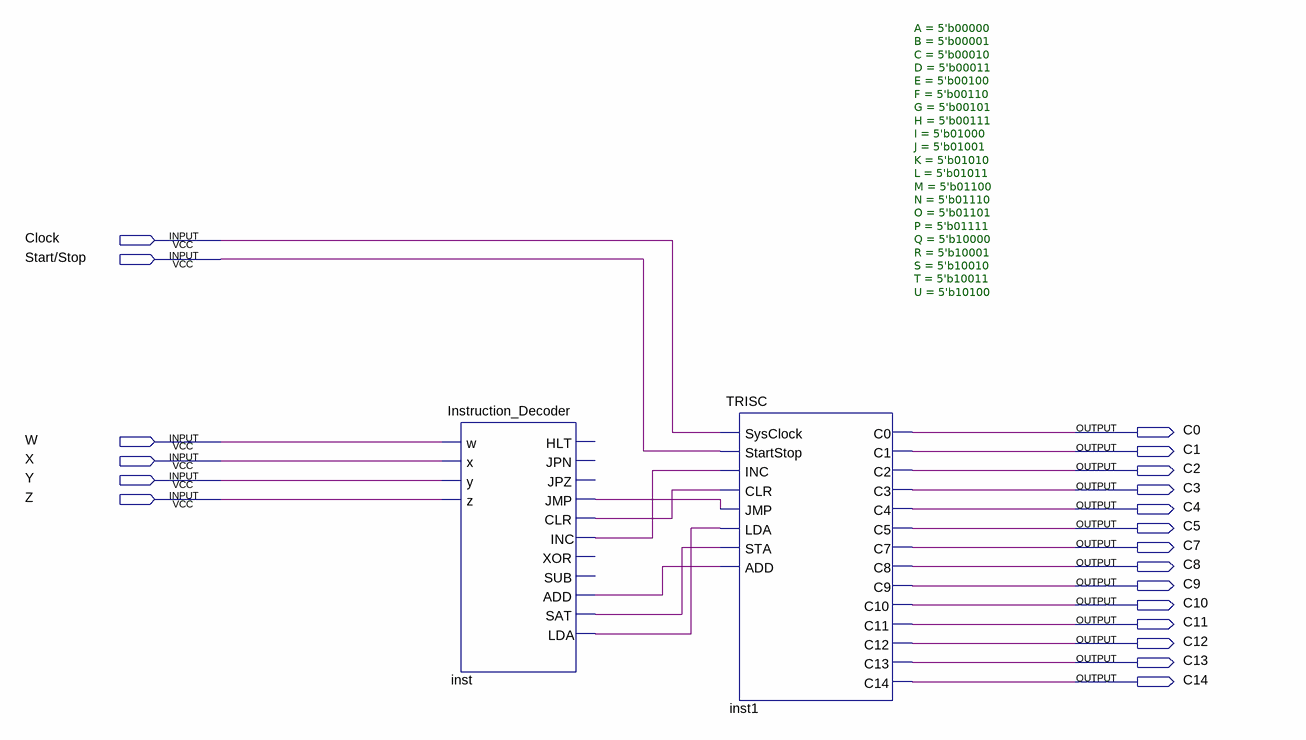
[diagram p0: schematic sheet]
// Quartus schematic LAB12TRISC.bdf as structural Verilog: 2 symbols, 20 pins
module LAB12TRISC (
  input  Clock,
  input  \Start/Stop ,
  input  W,
  input  X,
  input  Y,
  input  Z,
  output C0,
  output C1,
  output C2,
  output C3,
  output C4,
  output C5,
  output C7,
  output C8,
  output C9,
  output C10,
  output C11,
  output C12,
  output C13,
  output C14
);

  wire inst_add, inst_clr, inst_inc, inst_jmp, inst_lda, inst_sat;

  Instruction_Decoder inst (
    .w(W), .x(X), .y(Y), .z(Z), .JMP(inst_jmp), .CLR(inst_clr), .INC(inst_inc), .ADD(inst_add),
    .SAT(inst_sat), .LDA(inst_lda));  // open: HLT, JPN, JPZ, XOR, SUB
  TRISC #(.A(5'b00000), .B(5'b00001), .C(5'b00010), .D(5'b00011), .E(5'b00100), .F(5'b00110), .G(5'b00101), .H(5'b00111), .I(5'b01000), .J(5'b01001), .K(5'b01010), .L(5'b01011), .M(5'b01100), .N(5'b01110), .O(5'b01101), .P(5'b01111), .Q(5'b10000), .R(5'b10001), .S(5'b10010), .T(5'b10011), .U(5'b10100)) inst1 (
    .SysClock(Clock), .StartStop(\Start/Stop ), .INC(inst_inc), .CLR(inst_clr), .JMP(inst_jmp),
    .LDA(inst_lda), .STA(inst_sat), .ADD(inst_add), .C0(C0), .C1(C1), .C2(C2), .C3(C3), .C4(C4), .C5(C5),
    .C7(C7), .C8(C8), .C9(C9), .C10(C10), .C11(C11), .C12(C12), .C13(C13), .C14(C14));
endmodule
